# Altium schematic sheet Programmer.SchDoc
size A
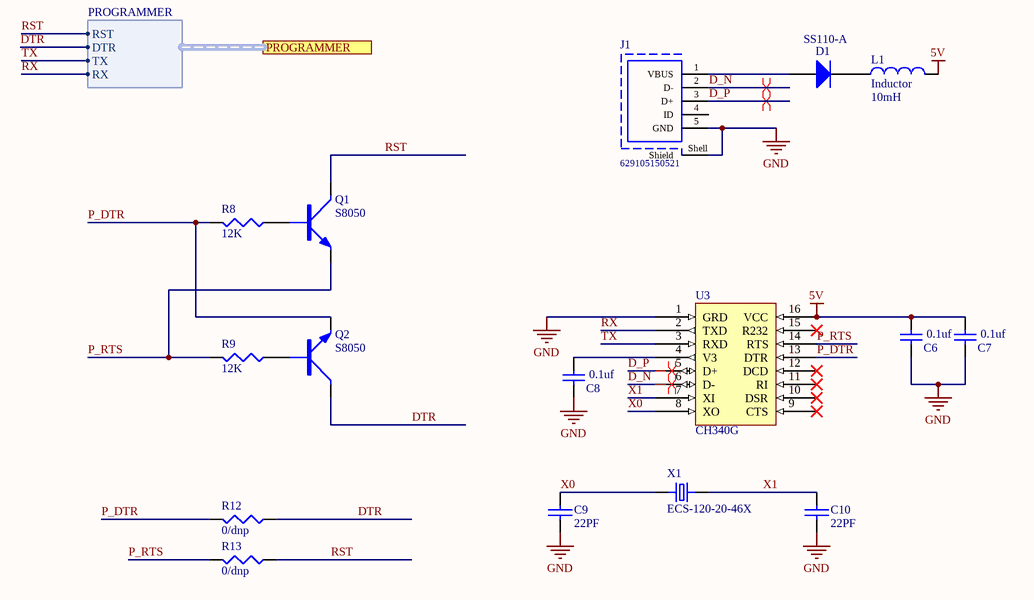
[diagram p0: Programmer.SchDoc]

## Parts
C6  0.1uf  [CAPC0603]
C7  0.1uf  [CAPC0603]
C8  0.1uf  [CAPC0603]
C9  22PF  [CAPC0603]
C10  22PF  [CAPC0603]
D1  SS110-A  [BZT55B13GS08]
J1  629105150521  [629105150521]
L1  Inductor  value 10mH  [CAPC0805]
Q1  S8050  [SOT23-3]
Q2  S8050  [SOT23-3]
R8  12K  [RESC0603]
R9  12K  [RESC0603]
R12  0/dnp  [RESC0603]
R13  0/dnp  [RESC0603]
U3  CH340G  [SOIC16_N]
X1  ECS-120-20-46X  [XTAL_ECS-120-20-46X]

## Ports
PROGRAMMER (harness PROGRAMMER)

## Harnesses
PROGRAMMER: RST, DTR, TX, RX

## Nets
5V: C6.1 C7.1 L1.2 U3.16(VCC)
GND: C6.2 C7.2 C8.2 C9.1 C10.1 J1.5(GND) J1.Shell(Shield) U3.1(GRD)
D_N: J1.2(D-) U3.6(D-)
D_P: J1.3(D+) U3.5(D+)
DTR: Q2.3(COLL) R12.1 ; port PROGRAMMER.DTR
P_DTR: Q2.2(EMIT) R8.2 R12.2 U3.13(DTR)
P_RTS: Q1.2(EMIT) R9.2 R13.2 U3.14(RTS)
RST: Q1.3(COLL) R13.1 ; port PROGRAMMER.RST
RX: U3.2(TXD) ; port PROGRAMMER.RX
TX: U3.3(RXD) ; port PROGRAMMER.TX
X0: C9.2 U3.8(XO) X1.1
X1: C10.2 U3.7(XI) X1.2
NetC8_1: C8.1 U3.4(V3)
NetD1_1: D1.1(A) L1.1
NetD1_2: D1.2(K) J1.1(VBUS)
NetQ1_1: Q1.1(BASE) R8.1
NetQ2_1: Q2.1(BASE) R9.1

Not connected (* = marked no-connect by the designer): J1 4(ID); U3 9(CTS)* 10(DSR)* 11(RI)* 12(DCD)* 15(R232)*

## Layout directives
differential pair: D_N, D_P

## Library data of the parts
C6-C8 = CMP-2007-04765-1: Part Number: 08055C104KAJ2A; Manufacturer: AVX Interconnect / Elco
C9 C10 = CAP NP
D1 = Diode: Default Diode; Published: 8-Jun-2000; LatestRevisionDate: 17-Jul-2002; LatestRevisionNote: Re-released for DXP Platform.; PackageVersion: Sep-1996; PackageReference: SMC; Publisher: Altium Limited; PackageDescription: DO-214-AB/SMC; 2 C-Bend Leads; Body 7.9 x 5.9 mm, inc. leads (LxW); Code_JEDEC: DO-214-AB
J1 = CMP-1502-03252-1: Micro USB 2.0 Type B Receptacle WR-COM, Horizontal, SMT, with Pegs, High Current at Pin 1 & Pin 5; Manufacturer: Wurth Elektronik; Contact Resistance: 30mOhm; Rated Current: 3A; Working Voltage: 30VAC; Package Reference: 629105150521; Mounting Technology: SMT; Connector Type: MicroUSB2.0TypeB; Operating Temperature: -40to85degC; Orientation: Horizontal; Manufacturer URL: http://www.we-online.de; Datasheet URL: https://katalog.we-online.de/em/datasheet/629105150521.pdf; Part Number: 629105150521; Packaging: TapeandReel; Gender: Receptacle; Publisher: WurthElektronik
L1 = Inductor: Code_IEC: 1005; Published: 8-Jun-2000; LatestRevisionDate: 29-May-2009; LatestRevisionNote: IPC-7351 Footprint Added.; PackageReference: 0402-A; Publisher: Altium Limited; PackageDescription: Chip Inductor; Code_JEITA: 0402
Q1 Q2 = NPN BEC
R8 R9 R12 R13 = RES1: RESISTOR
X1 = ECS-120-20-46X: QUARTZ CRYSTAL  T/H; Value: *